# Altium schematic sheet drivers_SCH.SchDoc
size A
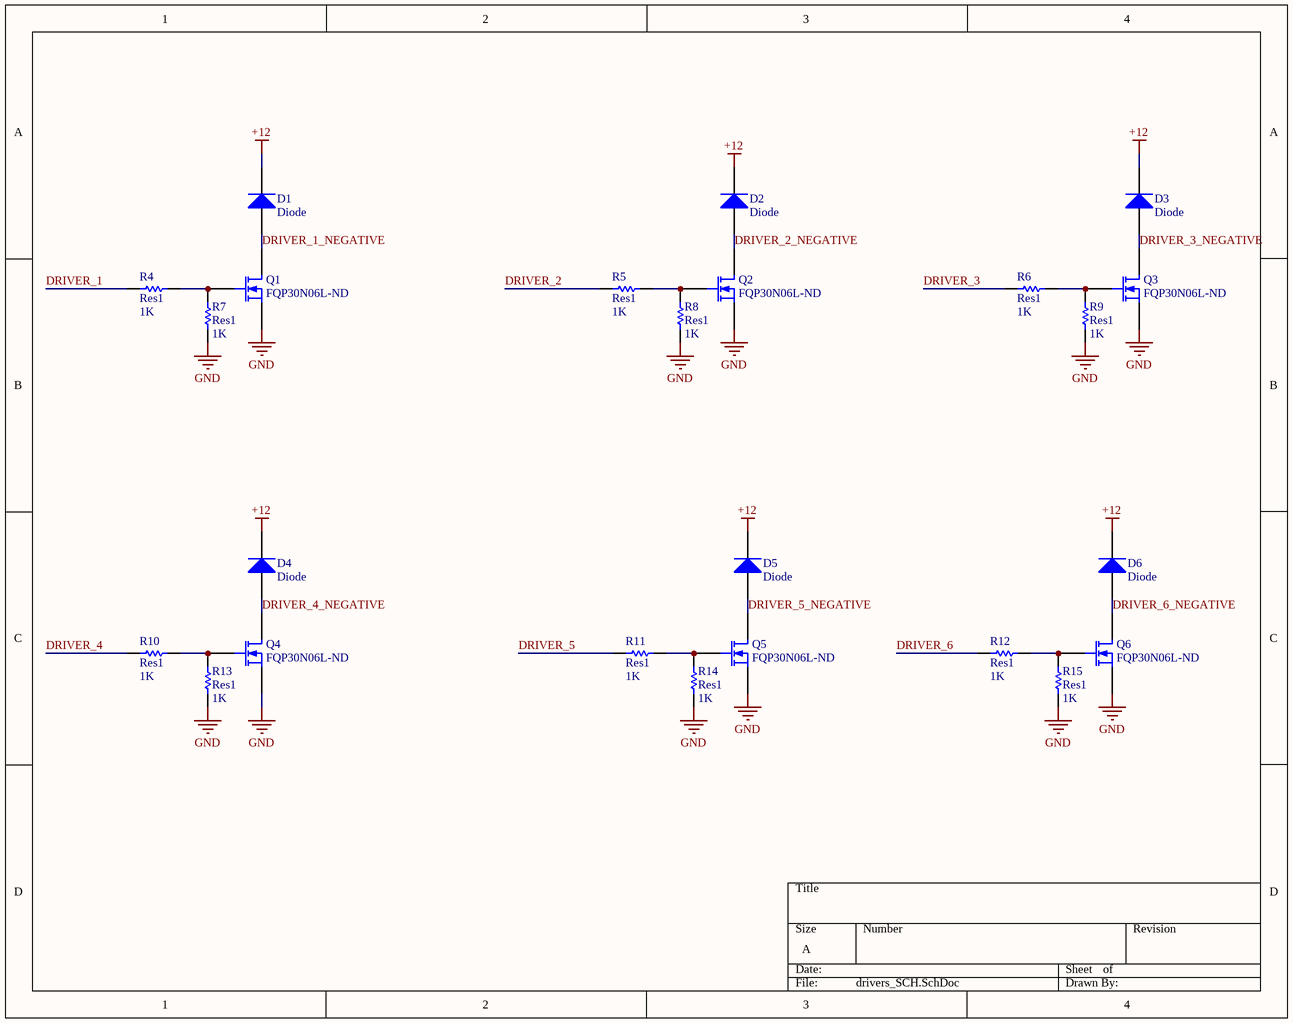
[diagram p0: drivers_SCH.SchDoc]

## Parts
D1  Diode  [DIOC2012X06N]
D2  Diode  [DIOC2012X06N]
D3  Diode  [DIOC2012X06N]
D4  Diode  [DIOC2012X06N]
D5  Diode  [DIOC2012X06N]
D6  Diode  [DIOC2012X06N]
Q1  FQP30N06L-ND  [UA78M]
Q2  FQP30N06L-ND  [UA78M]
Q3  FQP30N06L-ND  [UA78M]
Q4  FQP30N06L-ND  [UA78M]
Q5  FQP30N06L-ND  [UA78M]
Q6  FQP30N06L-ND  [UA78M]
R4  Res1  value 1K  [RESC_0805_2012]
R5  Res1  value 1K  [RESC_0805_2012]
R6  Res1  value 1K  [RESC_0805_2012]
R7  Res1  value 1K  [RESC_0805_2012]
R8  Res1  value 1K  [RESC_0805_2012]
R9  Res1  value 1K  [RESC_0805_2012]
R10  Res1  value 1K  [RESC_0805_2012]
R11  Res1  value 1K  [RESC_0805_2012]
R12  Res1  value 1K  [RESC_0805_2012]
R13  Res1  value 1K  [RESC_0805_2012]
R14  Res1  value 1K  [RESC_0805_2012]
R15  Res1  value 1K  [RESC_0805_2012]

## Nets
+12: D1.2(K) D2.2(K) D3.2(K) D4.2(K) D5.2(K) D6.2(K)
GND: Q1.3(S) Q2.3(S) Q3.3(S) Q4.3(S) Q5.3(S) Q6.3(S) R7.1 R8.1 R9.1 R13.1 R14.1 R15.1
DRIVER_1: R4.1
DRIVER_1_NEGATIVE: D1.1(A) Q1.2(G)
DRIVER_2: R5.1
DRIVER_2_NEGATIVE: D2.1(A) Q2.2(G)
DRIVER_3: R6.1
DRIVER_3_NEGATIVE: D3.1(A) Q3.2(G)
DRIVER_4: R10.1
DRIVER_4_NEGATIVE: D4.1(A) Q4.2(G)
DRIVER_5: R11.1
DRIVER_5_NEGATIVE: D5.1(A) Q5.2(G)
DRIVER_6: R12.1
DRIVER_6_NEGATIVE: D6.1(A) Q6.2(G)
NetQ1_1: Q1.1(D) R4.2 R7.2
NetQ2_1: Q2.1(D) R5.2 R8.2
NetQ3_1: Q3.1(D) R6.2 R9.2
NetQ4_1: Q4.1(D) R10.2 R13.2
NetQ5_1: Q5.1(D) R11.2 R14.2
NetQ6_1: Q6.1(D) R12.2 R15.2

## Library data of the parts
D1-D6 = Diode: Default Diode; Published: 8-Jun-2000; LatestRevisionDate: 17-Jul-2002; LatestRevisionNote: Re-released for DXP Platform.; PackageVersion: Sep-1996; PackageReference: SMC; Publisher: Altium Limited; PackageDescription: DO-214-AB/SMC; 2 C-Bend Leads; Body 7.9 x 5.9 mm, inc. leads (LxW); Code_JEDEC: DO-214-AB
Q1-Q6 = MOSFET-N: N-Channel MOSFET; Published: 8-Jun-2000; LatestRevisionDate: 17-Jul-2002; LatestRevisionNote: Re-released for DXP Platform.; PackageVersion: 1995/1996; PackageReference: E3; Publisher: Altium Limited; PackageDescription: TO, Flat Index; 3 In-Line, Axial Leads; Body Dia. 4.6mm; Lead Dia. 0.5 mm (max)
R4-R15 = Res1: Resistor; Published: 8-Jun-2000; LatestRevisionDate: 17-Jul-2002; LatestRevisionNote: Re-released for DXP Platform.; PackageReference: AXIAL-0.3; Publisher: Altium Limited; PackageDescription: Axial Device, Thru-Hole; 2 Leads; 0.3 in Pin Spacing